# Altium schematic sheet SCH_WETBCV1XX.SchDoc
size A4
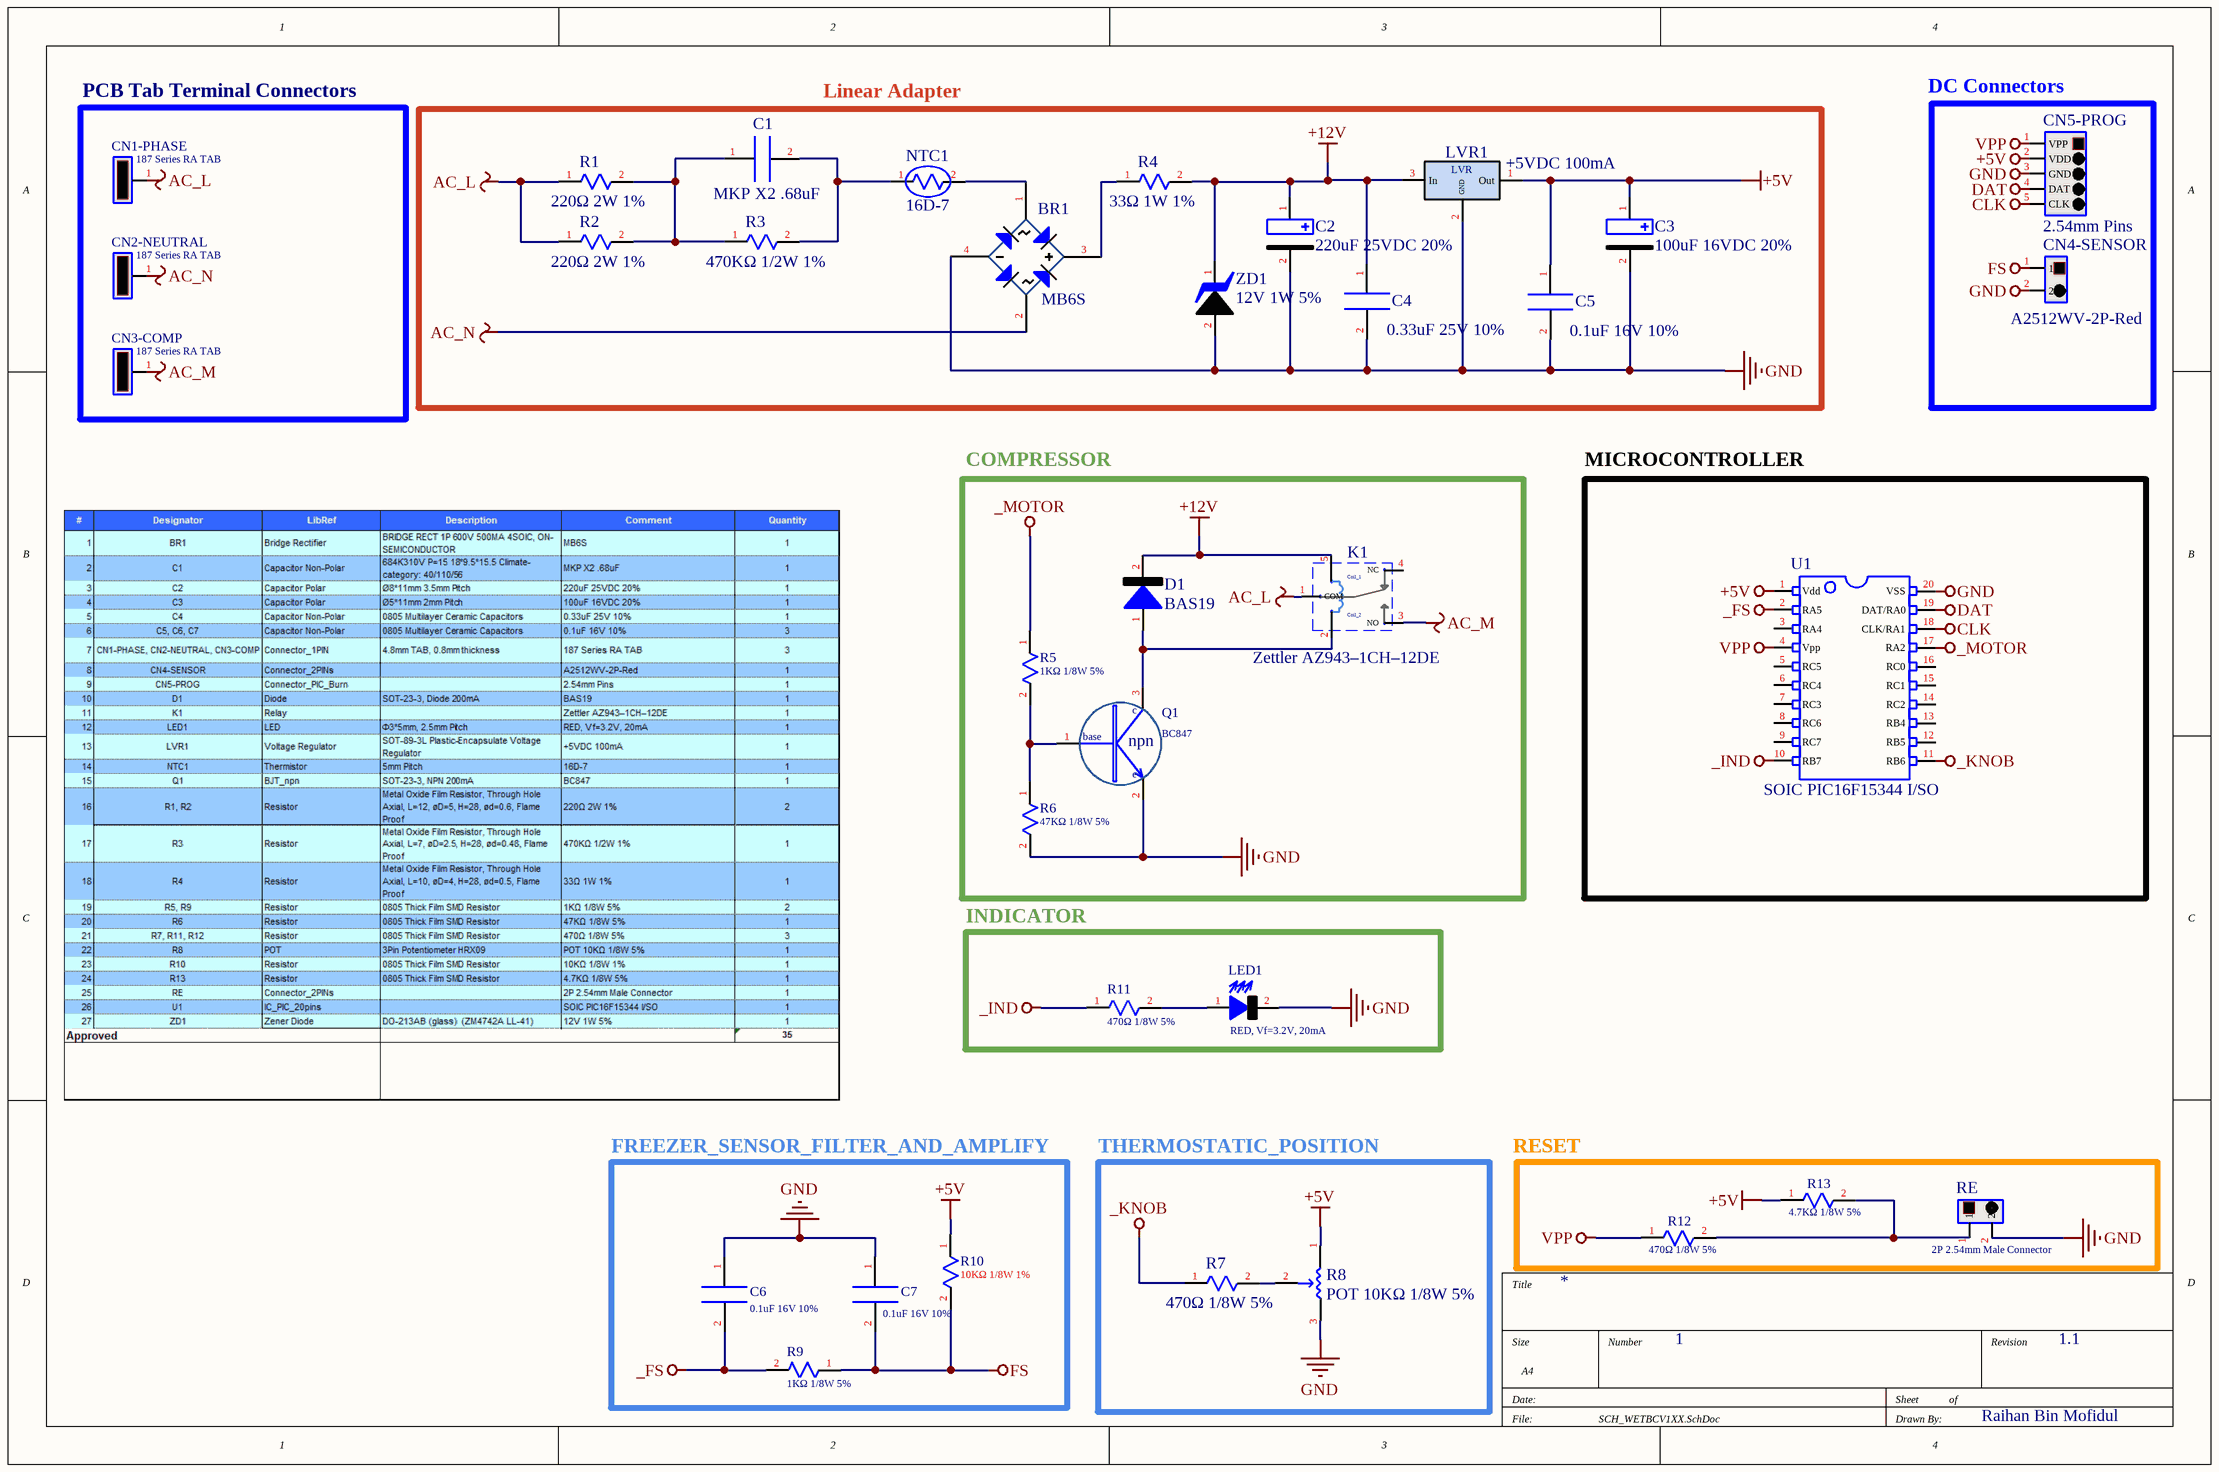
[diagram p0: SCH_WETBCV1XX.SchDoc]

## Parts
BR1  MB6S  [BR_SMD_MB6S]
C1  MKP X2 .68uF  [C_X2_18X10X15.8_P15]
C2  220uF 25VDC 20%  [C_Radial_P3.5]
C3  100uF 16VDC 20%  [C_Radial_P2]
C4  0.33uF 25V 10%  [C_0805]
C5  0.1uF 16V 10%  [C_0805]
C6  0.1uF 16V 10%  [C_0805]
C7  0.1uF 16V 10%  [C_0805]
CN1-PHASE  187 Series RA TAB  [CN_Tab Terminal 187 series (Right Angle)]
CN2-NEUTRAL  187 Series RA TAB  [CN_Tab Terminal 187 series (Right Angle)]
CN3-COMP  187 Series RA TAB  [CN_Tab Terminal 187 series (Right Angle)]
CN4-SENSOR  A2512WV-2P-Red  [CN_B2B-XH-A_WHITE]
CN5-PROG  2.54mm Pins  [CN_PIC_MCU_Debugger_Straight]
D1  BAS19  [D_SOT-23-3_200mA]
K1  Zettler AZ943–1CH–12DE  [K_15ARelay_AZ943-1CH-12DE]
LED1  RED, Vf=3.2V, 20mA  [LED_3x5_P2.5]
LVR1  +5VDC 100mA  [U_CJ78L05_SOT89]
NTC1  16D-7  [NTC_5mmPitch]
Q1  BC847  [Q_SOT-23-3_NPN_BC847]
R1  220Ω 2W 1%  [R_Axial_P15]
R2  220Ω 2W 1%  [R_Axial_P15]
R3  470KΩ 1/2W 1%  [R_Axial_P10]
R4  33Ω 1W 1%  [R_Axial_P15]
R5  1KΩ 1/8W 5%  [R_0805]
R6  47KΩ 1/8W 5%  [R_0805]
R7  470Ω 1/8W 5%  [R_0805]
R8  POT 10KΩ 1/8W 5%  [R_POT]
R9  1KΩ 1/8W 5%  [R_0805]
R10  10KΩ 1/8W 1%  [R_0805]
R11  470Ω 1/8W 5%  [R_0805]
R12  470Ω 1/8W 5%  [R_0805]
R13  4.7KΩ 1/8W 5%  [R_0805]
RE  2P 2.54mm Male Connector  [CN_PIC_MCU_Reseter_Straight]
U1  SOIC PIC16F15344 I/SO  [U_PIC16F15344_SOIC]
ZD1  12V 1W 5%  [ZD_ZM4742A LL-41]

## Blocks framed on the sheet
PCB Tab Terminal Connectors: CN1-PHASE CN2-NEUTRAL CN3-COMP
Linear Adapter: BR1 C1-C5 LVR1 NTC1 R1-R4 ZD1
DC Connectors: CN4-SENSOR CN5-PROG
COMPRESSOR: D1 K1 Q1 R5 R6
MICROCONTROLLER: U1
INDICATOR: LED1 R11
FREEZER_SENSOR_FILTER_AND_AMPLIFY: C6 C7 R9 R10
THERMOSTATIC_POSITION: R7 R8
RESET: R12 R13 RE

## Nets
+5V: C3.1(vdd) C5.1 CN5-PROG.2(VDD) LVR1.1(Out) R8.1(VDD) R10.1 R13.1 U1.1(Vdd)
+12V: C2.1(vdd) C4.1 D1.2(vss) K1.5(COIL1) LVR1.3(In) R4.2 ZD1.1(VCC)
_FS: C6.2 R9.2 U1.2(RA5)
_IND: R11.1 U1.10(RB7)
_KNOB: R7.1 U1.11(RB6)
_MOTOR: R5.1 U1.17(RA2)
AC_L: CN1-PHASE.1 K1.1(COM) R1.1 R2.1
AC_M: CN3-COMP.1 K1.3(NO)
AC_N: BR1.2(AC) CN2-NEUTRAL.1
CLK: CN5-PROG.5(CLK) U1.18(CLK/RA1)
DAT: CN5-PROG.4(DAT) U1.19(DAT/RA0)
FS: C7.2 CN4-SENSOR.1 R9.1 R10.2
GND: BR1.4(vss) C2.2(vss) C3.2(vss) C4.2 C5.2 C6.1 C7.1 CN4-SENSOR.2 CN5-PROG.3(GND) LED1.2(vss) LVR1.2(GND) Q1.2(Emitter) R6.2 R8.3(VSS) RE.2 U1.20(VSS) ZD1.2(GND)
VPP: CN5-PROG.1(VPP) R12.1 U1.4(Vpp)
NetBR1_1: BR1.1(AC) NTC1.2
NetBR1_3: BR1.3(VCC) R4.1
NetC1_1: C1.1 R1.2 R2.2 R3.1
NetC1_2: C1.2 NTC1.1 R3.2
NetD1_1: D1.1(vdd) K1.2(COIL2) Q1.3(Collector)
NetLED1_1: LED1.1(vdd) R11.2
NetQ1_1: Q1.1(Base) R5.2 R6.1
NetR7_2: R7.2 R8.2(POT)
NetR12_2: R12.2 R13.2 RE.1

Not connected (* = marked no-connect by the designer): K1 4(NC); U1 3(RA4) 5(RC5) 6(RC4) 7(RC3) 8(RC6) 9(RC7) 12(RB5) 13(RB4) 14(RC2) 15(RC1) 16(RC0)

## Notes on the sheet
- 1
- 1.1
- Raihan Bin Mofidul
- (in symbol BJT_npn) c; base; npn; e
- (in symbol POT) Var
- (in symbol Relay) Coil_1; Coil_2
- (in symbol Voltage Regulator) LVR

## Library data of the parts
BR1 = Bridge Rectifier: BRIDGE RECT 1P 600V 500MA 4SOIC, ON-SEMICONDUCTOR
C1 = Capacitor Non-Polar: 684K310V P=15 18*9.5*15.5 Climate-category: 40/110/56
C2 = Capacitor Polar: Ø8*11mm 3.5mm Pitch
C3 = Capacitor Polar: Ø5*11mm 2mm Pitch
C4-C7 = Capacitor Non-Polar: 0805 Multilayer Ceramic Capacitors
CN1-PHASE CN2-NEUTRAL CN3-COMP = Connector_1PIN: 4.8mm TAB, 0.8mm thickness
CN4-SENSOR RE = Connector_2PINs
CN5-PROG = Connector_PIC_Burn
D1 = Diode: SOT-23-3, Diode 200mA
K1 = Relay
LED1 = LED: Φ3*5mm, 2.5mm Pitch
LVR1 = Voltage Regulator: SOT-89-3L Plastic-Encapsulate Voltage Regulator
NTC1 = Thermistor: 5mm Pitch
Q1 = BJT_npn: SOT-23-3, NPN 200mA
R1 R2 = Resistor: Metal Oxide Film Resistor, Through Hole Axial, L=12, øD=5, H=28, ød=0.6, Flame Proof
R3 = Resistor: Metal Oxide Film Resistor, Through Hole Axial, L=7, øD=2.5, H=28, ød=0.48, Flame Proof
R4 = Resistor: Metal Oxide Film Resistor, Through Hole Axial, L=10, øD=4, H=28, ød=0.5, Flame Proof
R5-R7 R9-R13 = Resistor: 0805 Thick Film SMD Resistor
R8 = POT: 3Pin Potentiometer HRX09
U1 = IC_PIC_20pins
ZD1 = Zener Diode: DO-213AB (glass)  (ZM4742A LL-41)